# Altium schematic sheet Communication.SchDoc
size A
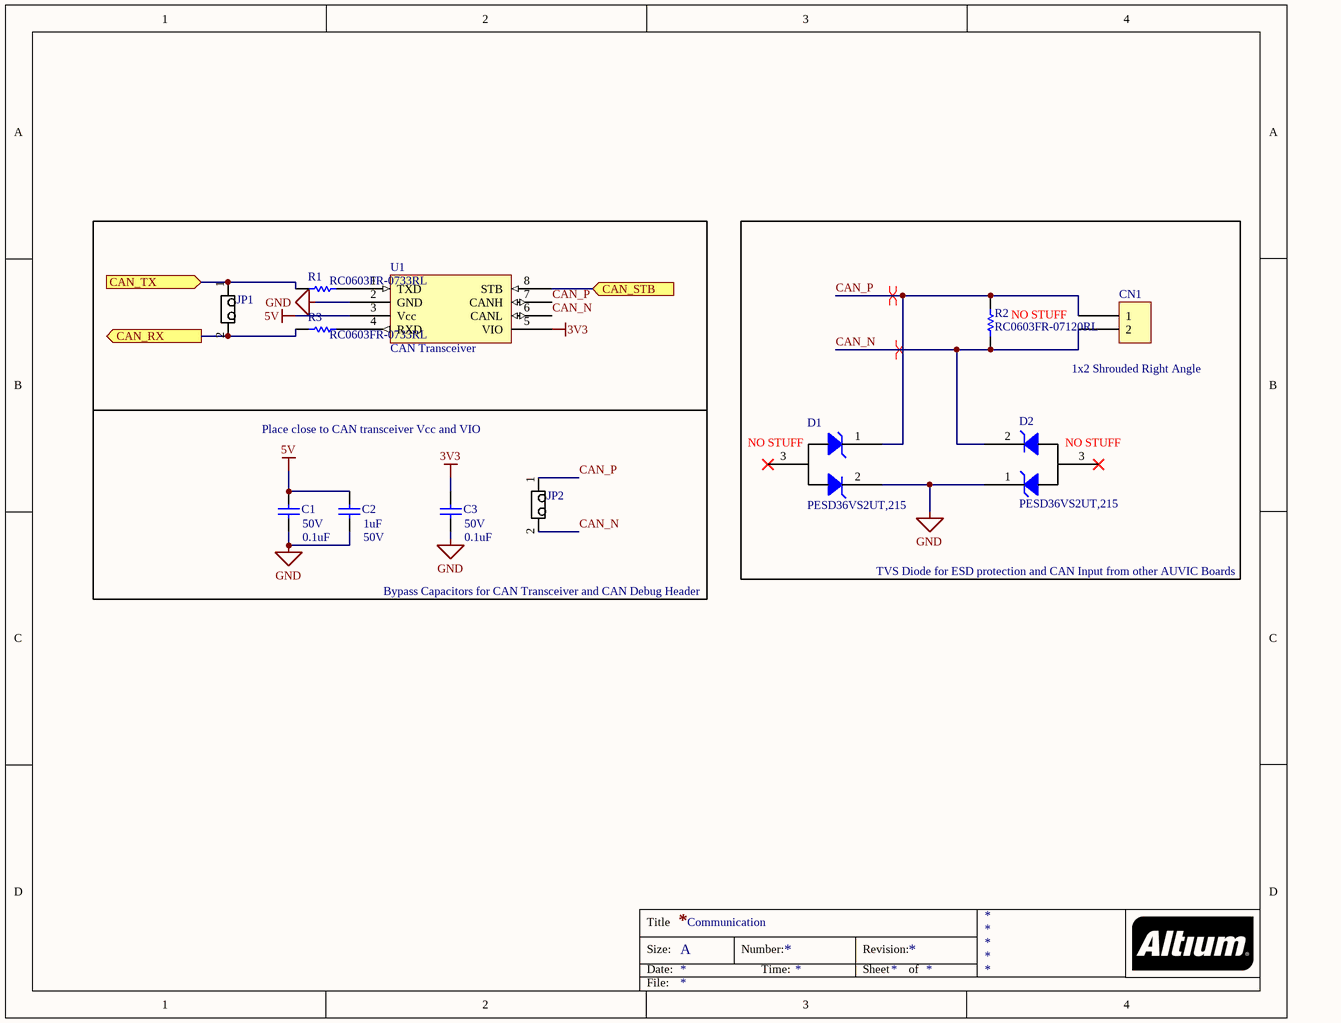
[diagram p0: Communication.SchDoc]

## Parts
C1  Voltage: 50V  Capacitance: 0.1uF  [FP-CL10-0_1-IPC_A]  (hidden comment: CL10B104JB8NNNC)
C2  Capacitance: 1uF  Voltage: 50V  [0803 CAP]  (hidden comment: CL21B105KBFNNNG)
C3  Voltage: 50V  Capacitance: 0.1uF  [FP-CL10-0_1-IPC_A]  (hidden comment: CL10B104JB8NNNC)
CN1  1x2 Shrouded Right Angle  [2X1 Female Header]
D1  PESD36VS2UT,215  [SOT95P245X110-3N]
D2  PESD36VS2UT,215  [SOT95P245X110-3N]
JP1  1x2 Male Header  [2X1 Males Header]  (value not drawn)
JP2  1x2 Male Header  [2X1 Males Header]  (value not drawn)
R1  RC0603FR-0733RL  [RESC1608X55X25LL10T15]
R2  RC0603FR-07120RL  [RESC1608X55X25ML10T15]
R3  RC0603FR-0733RL  [RESC1608X55X25LL10T15]
U1  CAN Transceiver  [8-SOIC]

## Ports
CAN_RX (out), CAN_STB (in), CAN_TX (in)

## Nets
3V3: C3.1 U1.5(VIO)
5V: C1.1 C2.1 U1.3(Vcc)
GND: C1.2 C2.2 C3.2 D1.2(Cathode_2) D2.1(Cathode_1) U1.2(GND)
CAN_N: CN1.2 D2.2(Cathode_2) JP2.2 R2.2 U1.6(CANL)
CAN_P: CN1.1 D1.1(Cathode_1) JP2.1 R2.1 U1.7(CANH)
CAN_RX: JP1.2 R3.1 ; port CAN_RX
CAN_STB: U1.8(STB) ; port CAN_STB
CAN_TX: JP1.1 R1.1 ; port CAN_TX
NetR1_2: R1.2 U1.1(TXD)
NetR3_2: R3.2 U1.4(RXD)

Not connected (* = marked no-connect by the designer): D1 3(Common_Anode); D2 3(Common_Anode)

## Layout directives
differential pair: CAN_N, CAN_P

## Notes on the sheet
- (near R2) NO STUFF
- Place close to CAN transceiver Vcc and VIO
- (near D1) NO STUFF
- (near D2) NO STUFF
- Bypass Capacitors for CAN Transceiver and CAN Debug Header
- TVS Diode for ESD protection and CAN Input from other AUVIC Boards
- Communication
- Title
- Size:
- Date:
- A
- Number:
- Time:
- Revision:
- Sheet
- of
- File:

## Library data of the parts
C1 C3 = CMP-00000-4: CAP CER 0.1UF 50V X7R 0603; Tolerance: 5%; Material: Ceramic; Case Code (Imperial): 0603; Mount: Surface Mount; Thickness: 0.035inch; Depth: 0.8mm; Packaging: Tape and Reel; Package Quantity: 1; Dielectric: X7R; Height: 0.8mm; Radiation Hardening: No; Max Operating Temperature: 125°C; Voltage Rating: 50V; Case/Package: 0603; Min Operating Temperature: -55°C; Case Code (Metric): 1608; Length: 1.6mm; Contact Plating: Tin; Width: 0.031inch
C2 = CMP-00005-3: SAMSUNG ELECTRO-MECHANICS - CL21B105KBFNNNG - MLCC CAPACITORS; Tolerance: 10%; Material: Ceramic; Dielectric: X7R; Case/Package: 0805; Voltage Rating: 50V; Contact Plating: Tin; Max Operating Temperature: 125°C; Termination: Wraparound; Package Quantity: 3000; Depth: 1.25mm; Mount: Surface Mount; Min Operating Temperature: -55°C; Thickness: 0.053inch; Packaging: Tape and Reel; Case Code (Metric): 2012; Length: 2mm; Case Code (Imperial): 0805; Width: 0.049inch
CN1 = CMP-00010-3: 02 MTE HDR SRRA LATCH; PCB Mount Retention: Without; Number of Positions: 2; Row Spacing: 0.1inch; Contact Retention: Yes (With); PCB Mount Alignment: No (Without); Current Rating: 3A; PCB Thickness: 0.062inch; Insulation Resistance: 5GR; Gender: Male; Connector Type: Plug,Header,Pin; Tail Length: 3.3mm; Approvals: CSA; Pitch: 2.54mm; Contact Resistance: 15mR; Color: Black; REACH SVHC: Unknown; Contact Shape: Square; Number of Contacts: 2; PCB Mounting Orientation: Right Angle; Housing Material: Thermoplastic; Max Operating Temperature: 105°C; Mount: Through Hole; Package Quantity: 68; Contact Current Rating: 3A; Housing Color: Black; Contact Material: Brass; Min Operating Temperature: -65°C; Packaging: Rail/Tube; Height: 13.59mm; ELV: Compliant; Number of Rows: 1; Orientation: Right Angle; Lead Free: Lead Free; Mating Retention: Yes (With); Strain Relief: No (Without); Length: 7.62mm; Flammability Rating: UL94 V-0; Contact Plating: Gold,Tin,Matte; Contact Mating Length: 0.23inch; Contact Gender: Male; Termination: Crimp; Backwall/Post Interruptions: No (Without); Depth: 13.59mm; Mating Alignment: Yes (With)
D1 D2 = CMP-058-0000-2: TVS DIODE 36V 60V SOT23; Created By: Miguel Manguerra; Date Created: 2020-05-18; Design Item ID: PESD36VS2UT,215; Component Type: Standard; Pin Count: 3; Source: AUVic_Schematic_Library_Diodes.SchLib
JP1 JP2 = CMP-004-0001-1: Made By: Andy Bates; Source: AUVic_Schematic_Library_Connectors.SchLib; Pin Count: 2; Design Item ID: 1x2 Male Header; Component Type: Standard
R1 R3 = CMP-00060-1: Res Thick Film 0603 33 Ohm 1% 1/10W +/-100ppm/ßC Molded SMD Paper T/R; Max Power Dissipation: 100mW; Voltage Rating: 75V; Resistance: 33R; Voltage Rating (DC): 50V; Temperature Coefficient: 100ppm/°C; Depth: 0.8mm; Military Standard: Not; Min Operating Temperature: -55°C; Termination: SMD/SMT; Weight: 7.1E-05oz; Number of Terminations: 2; Height: 0.45mm; Power Rating: 100mW; Composition: Thick Film; Length: 1.6mm; Packaging: Tape and Reel; Lead Pitch: 0.3mm; Lead Free: Lead Free; Max Operating Temperature: 155°C; REACH SVHC: No SVHC; Features: Moisture Resistant; Tolerance: 1%; Case/Package: 0603; Package Quantity: 1; Width: 0.8mm; Case Code (Metric): 1608; Number of Pins: 2; Case Code (Imperial): 0603
R2 = CMP-00061-1: Res Thick Film 0603 120 Ohm 1% 0.1W(1/10W) ±100ppm/C Epoxy SMD T/R; Power Rating: 100mW; Voltage Rating (DC): 50V; Temperature Coefficient: 100ppm/°C; Resistance: 120R; Depth: 0.8mm; Max Operating Temperature: 155°C; Case/Package: 0603; Lead Free: Lead Free; Height: 0.022inch; Length: 1.6mm; Case Code (Metric): 1608; Package Quantity: 1; Features: Moisture Resistant; Termination: SMD/SMT; Military Standard: Not; Number of Pins: 2; Width: 0.031inch; REACH SVHC: No SVHC; Max Power Dissipation: 100mW; Min Operating Temperature: -55°C; Packaging: Tape and Reel; Composition: Thick Film; Tolerance: 1%; Voltage Rating: 50V; Number of Terminations: 2; Case Code (Imperial): 0603
U1 = CMP-032-0000-2: 1/1 Transceiver Half CANbus 8-SO; Data Rate: 1Mbps; Max Supply Voltage: 5.5V; Propagation Delay: 250ns; Number of Transceivers: 1; Nominal Supply Current: 70mA; Min Supply Voltage: 4.5V; Min Operating Temperature: -40°C; Radiation Hardening: No; Packaging: Tape and Reel; Turn-On Delay Time: 250ns; Case/Package: SO; Contact Plating: Gold; Package Quantity: 2500; Number of Pins: 8; Max Supply Current: 70mA; Max Operating Temperature: 150°C; Interface: CAN; Mount: Surface Mount; Lead Free: Lead Free